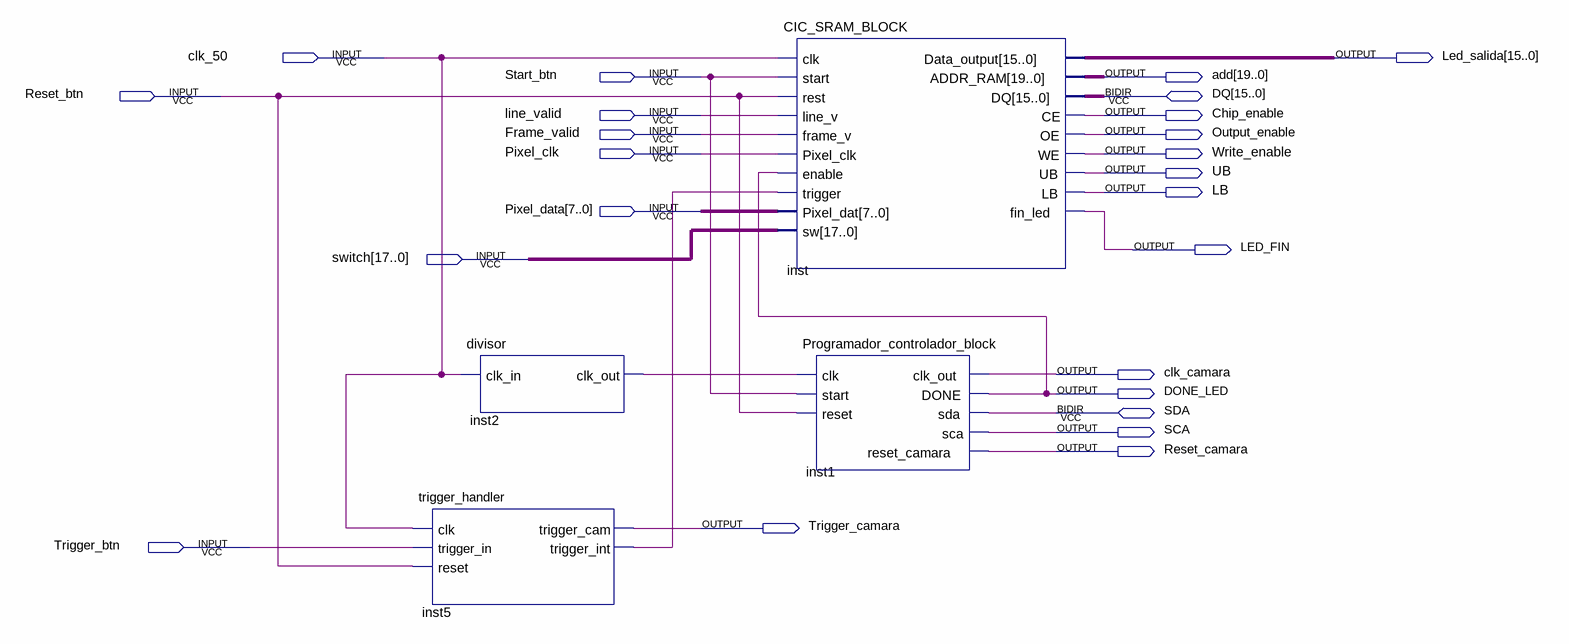
[diagram p0: schematic sheet]
// Quartus schematic Todo_junto.bdf as structural Verilog: 4 symbols, 24 pins
module Todo_junto (
  input  clk_50,
  input  Start_btn,
  input  Reset_btn,
  input  line_valid,
  input  Frame_valid,
  input  Pixel_clk,
  input  [7:0] Pixel_data,
  input  [17:0] switch,
  input  Trigger_btn,
  inout  [15:0] DQ,
  inout  SDA,
  output [15:0] Led_salida,
  output [19:0] add,
  output Chip_enable,
  output Output_enable,
  output Write_enable,
  output UB,
  output LB,
  output LED_FIN,
  output clk_camara,
  output DONE_LED,
  output SCA,
  output Reset_camara,
  output Trigger_camara
);

  wire inst2_clk_out, inst5_trigger_int;

  trigger_handler inst5 (
    .clk(clk_50), .trigger_in(Trigger_btn), .reset(Reset_btn), .trigger_cam(Trigger_camara),
    .trigger_int(inst5_trigger_int));
  divisor inst2 (.clk_in(clk_50), .clk_out(inst2_clk_out));
  CIC_SRAM_BLOCK inst (
    .clk(clk_50), .start(Start_btn), .rest(Reset_btn), .line_v(line_valid), .frame_v(Frame_valid),
    .Pixel_clk(Pixel_clk), .enable(DONE_LED), .trigger(inst5_trigger_int), .Pixel_dat(Pixel_data),
    .sw(switch), .Data_output(Led_salida), .ADDR_RAM(add), .CE(Chip_enable), .OE(Output_enable),
    .WE(Write_enable), .UB(UB), .LB(LB), .fin_led(LED_FIN), .DQ(DQ));
  Programador_controlador_block inst1 (
    .clk(inst2_clk_out), .start(Start_btn), .reset(Reset_btn), .clk_out(clk_camara), .DONE(DONE_LED),
    .sca(SCA), .reset_camara(Reset_camara), .sda(SDA));
endmodule
